# EAGLE schematic Alarm_clock (EAGLE 7.3.0)
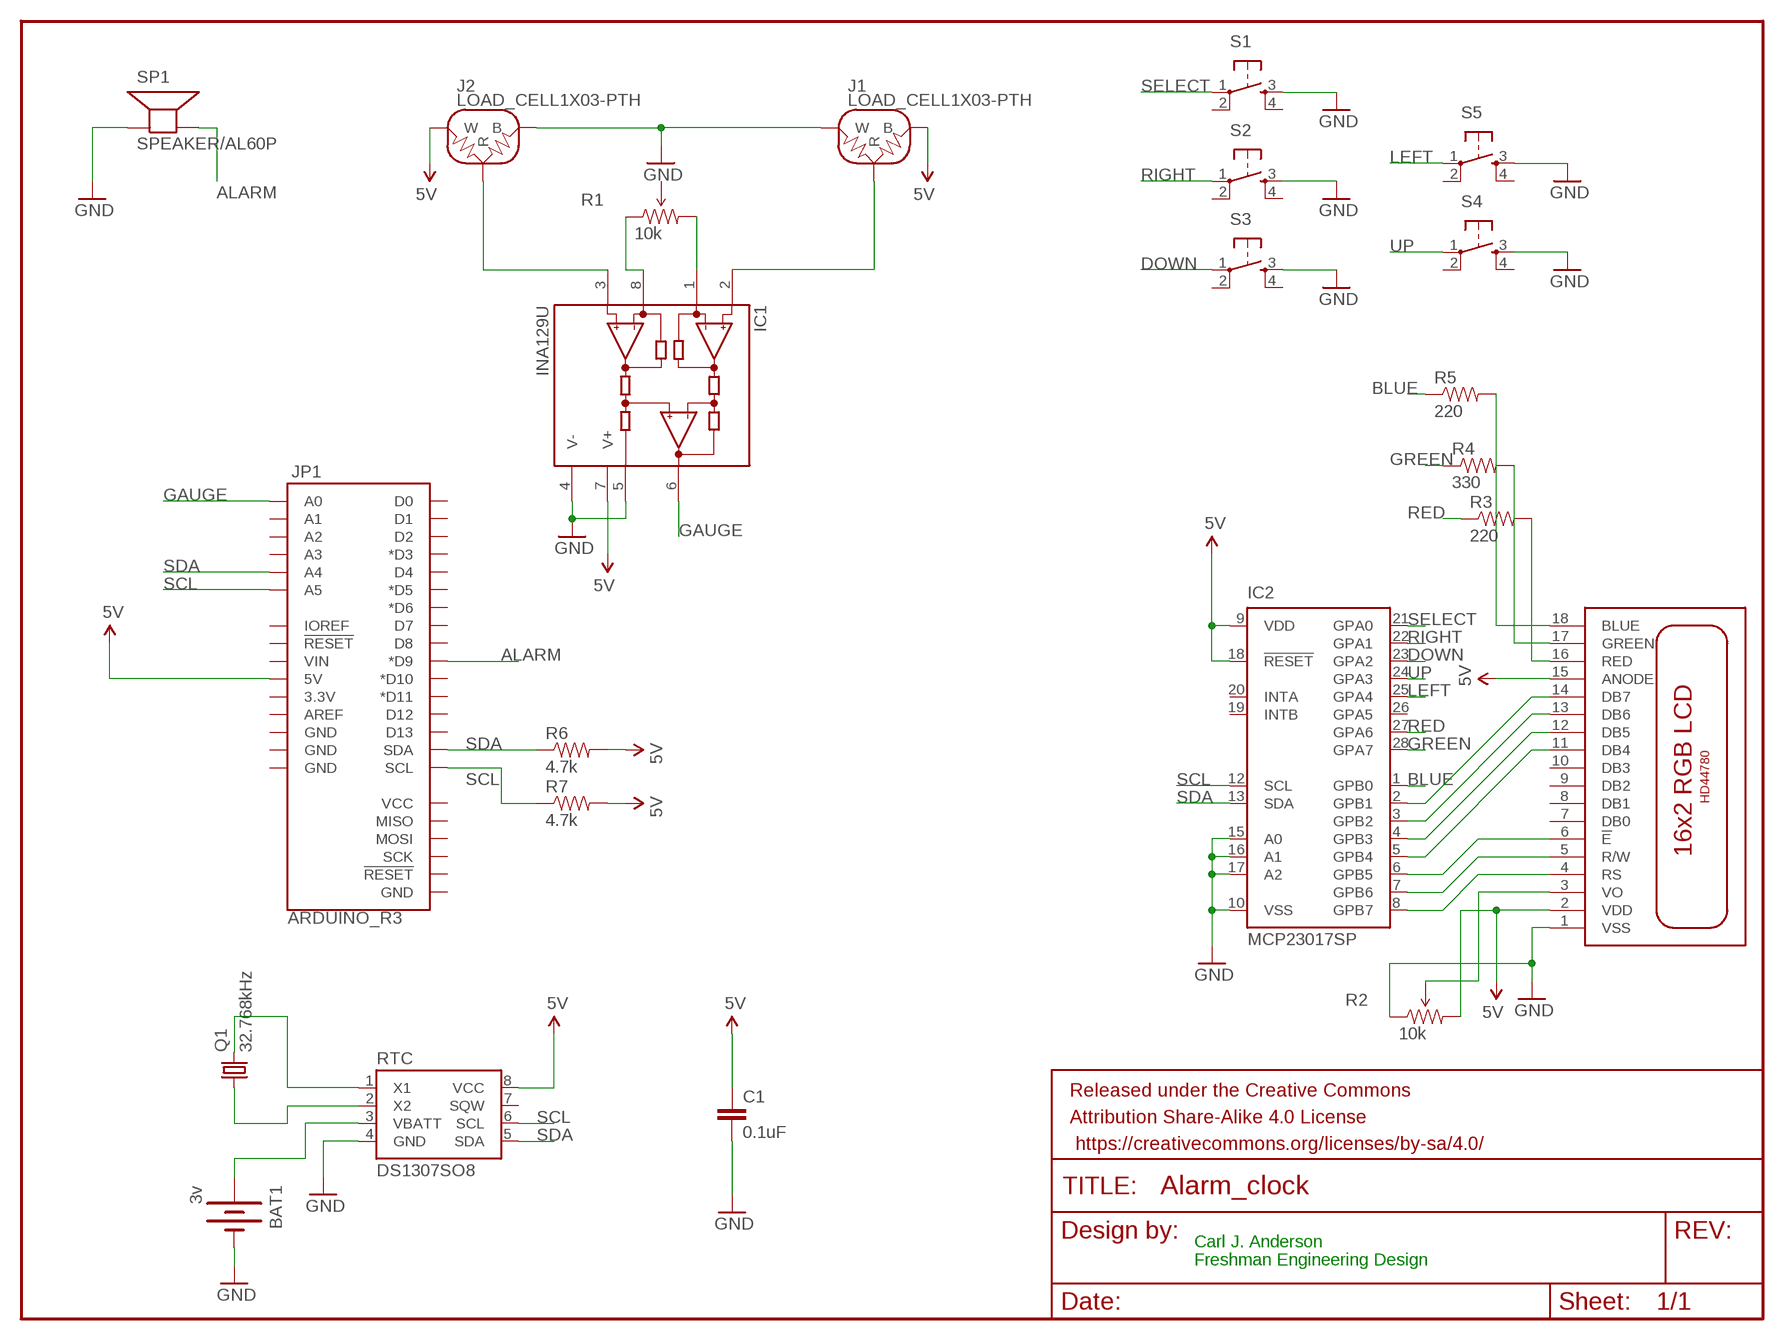
[diagram p0: schematic, sheet 1]

## Parts
BAT1  3v  BATTERYFOB  [BATTERY_20MM_PTH_COMPACT]
C1  0.1uF  0.1UF-16V(+-10%)(0402)  [0402-CAP]
FRAME1  FRAME-LETTER  [CREATIVE_COMMONS]
IC1  INA129U  [SO08]
IC2  MCP23017SP  [DIL28-3]
J1  LOAD_CELL1X03-PTH  [1X03]
J2  LOAD_CELL1X03-PTH  [1X03]
JP1  ARDUINO_R3  [ARDUINO_R3]
Q1  32.768kHz  CRYSTALTC26H  [TC26H]
R1  10k  TRIMPOT  [TRIMPOT-5MM-V2]
R2  10k  TRIMPOT  [TRIMPOT-5MM-V2]
R3  220  RESISTORPTH-1/4W  [AXIAL-0.4]
R4  330  RESISTORPTH-1/4W  [AXIAL-0.4]
R5  220  RESISTORPTH-1/4W  [AXIAL-0.4]
R6  4.7k  RESISTORPTH-1/4W  [AXIAL-0.4]
R7  4.7k  RESISTORPTH-1/4W  [AXIAL-0.4]
RTC  DS1307SO8  [SO08]
S1  TAC_SWITCHPTH  [TACTILE-PTH]
S2  TAC_SWITCHPTH  [TACTILE-PTH]
S3  TAC_SWITCHPTH  [TACTILE-PTH]
S4  TAC_SWITCHPTH  [TACTILE-PTH]
S5  TAC_SWITCHPTH  [TACTILE-PTH]
SP1  SPEAKER/AL60P  [AL60P]
U$1  LCD16X2-RGB  [LCD16X2-RGB]

## Nets
5V: C1.1 IC1.7(V+) IC2.9(VDD) IC2.18(!RESET) J1.1(B) J2.2(W) JP1.5V R2.C(CW) R6.P$2 R7.P$2 RTC.8(VCC) U$1.2(VDD) U$1.15(ANODE)
ALARM: JP1.D9(*D9) SP1.2(-)
BLUE: IC2.1(GPB0) R5.P$1
DOWN: IC2.23(GPA2) S3.1
GAUGE: IC1.6(OUT) JP1.A0
GND: BAT1.2(-) C1.2 IC1.4(V-) IC1.5(REF) IC2.10(VSS) IC2.15(A0) IC2.16(A1) IC2.17(A2) J1.2(W) J2.1(B) R2.A(CCW) RTC.4(GND) S1.3 S2.3 S3.3 S4.3 S5.3 SP1.1(+) U$1.1(VSS)
GREEN: IC2.28(GPA7) R4.P$1
LEFT: IC2.25(GPA4) S5.1
N$1: Q1.2 RTC.1(X1)
N$2: Q1.1 RTC.2(X2)
N$3: BAT1.1(+) RTC.3(VBATT)
N$4: R2.B(WIPER) U$1.3(VO)
N$5: IC2.8(GPB7) U$1.4(RS)
N$6: IC2.7(GPB6) U$1.5(R/W)
N$7: IC1.3(+IN) J2.3(R)
N$8: IC1.2(-IN) J1.3(R)
N$9: IC1.1(RG) R1.C(CW)
N$10: IC1.8(RG) R1.A(CCW)
N$11: IC2.6(GPB5) U$1.6(!E!)
N$12: IC2.5(GPB4) U$1.11(DB4)
N$13: IC2.4(GPB3) U$1.12(DB5)
N$14: IC2.3(GPB2) U$1.13(DB6)
N$15: IC2.2(GPB1) U$1.14(DB7)
N$16: R3.P$2 U$1.16(RED)
N$17: R4.P$2 U$1.17(GREEN)
N$18: R5.P$2 U$1.18(BLUE)
RED: IC2.27(GPA6) R3.P$1
RIGHT: IC2.22(GPA1) S2.1
SCL: IC2.12(SCL) JP1.A5 JP1.SCL R7.P$1 RTC.6(SCL)
SDA: IC2.13(SDA) JP1.A4 JP1.SDA R6.P$1 RTC.5(SDA)
SELECT: IC2.21(GPA0) S1.1
UP: IC2.24(GPA3) S4.1
Unconnected: IC2.19(INTB) IC2.20(INTA) IC2.26(GPA5) JP1.3.3V JP1.A1 JP1.A2 JP1.A3 JP1.AREF JP1.D0 JP1.D1 JP1.D2 JP1.D3(*D3) JP1.D4 JP1.D5(*D5) JP1.D6(*D6) JP1.D7 JP1.D8 JP1.D10(*D10) JP1.D11(*D11) JP1.D12 JP1.D13 JP1.GND@1(GND) JP1.GND@2(GND) JP1.GND@3(GND) JP1.GND@4(GND) JP1.IOREF JP1.MISO JP1.MOSI JP1.RESET@1(!RESET!) JP1.RESET@2(!RESET!) JP1.SCK JP1.VCC JP1.VIN R1.B(WIPER) RTC.7(SQW) S1.2 S1.4 S2.2 S2.4 S3.2 S3.4 S4.2 S4.4 S5.2 S5.4 U$1.7(DB0) U$1.8(DB1) U$1.9(DB2) U$1.10(DB3)

## Notes on the sheet
- Carl J. Anderson
- Freshman Engineering Design

## Library data of the parts
BAT1 = SparkFun-Electromechanical:BATTERY: Battery Holders Various common sizes : AA, AAA, 18650 (PRT-12895), 20mm coin cell and 12mm coin cell. 20MM_4LEGS, BATT-10373
C1 = SparkFun-Capacitors:0.1UF-16V(+-10%)(0402); PROD_ID: CAP-12416
FRAME1 = SparkFun-Aesthetics:FRAME-LETTER: Schematic Frame Standard 8.5x11 US Letter frame
IC1 = burr-brown:INA129: Instrumentation Amplifiers Precision, Low Power; MF: TEXAS INSTRUMENTS; MPN: INA129U; OC_FARNELL: 1212415; OC_NEWARK: 35C1732
IC2 = microchip:MCP23017: http://ww1.microchip.com/downloads/en/DeviceDoc/21952a.pdf Source: http://ww1.microchip.com/downloads/en/DeviceDoc/21952a.pdf; MF: MICROCHIP; MPN: MCP23017-E/SP; OC_FARNELL: 1332088; OC_NEWARK: 31K2959
J1 J2 = SparkFun-Sensors:LOAD_CELL: Half-wheatstone bridge Load Cell
JP1 = SparkFun-Boards:ARDUINO_R3: Arduino R3 Footprint (w/ SPI header)
Q1 = SparkFun-FreqCtrl:CRYSTAL: Various standard crystals. Proven footprints.; PROD_ID: XTAL-10112
R1 R2 = SparkFun-Electromechanical:TRIMPOT: Various small potentiometers for "set-and-forget" applications
R3-R7 = SparkFun-Passives:RESISTOR: Resistor Basic schematic elements and footprints for 0603, 1206, and PTH resistors.
RTC = SparkFun-FreqCtrl:DS1307: I2C real-time clock with battery backup.
S1-S5 = SparkFun-Retired:TAC_SWITCH: Momentary Switch Button commonly used for reset or general input. Spark Fun Electronics SKU : COM-00097 SMT- SWCH-08247
SP1 = adafruit:SPEAKER: SPEAKER Source: Buerklin Added PS12 (for part # PS1240 piezo) http://www.ladyada.net/library/pcb/eaglelibrary.html
U$1 = GeekAmmo:LCD16X2-RGB: GeekAmmo LCD 16x2 RGB GMO-00056 Negative GMO-00057 Positive